# EAGLE design main (EAGLE 7.7.0)
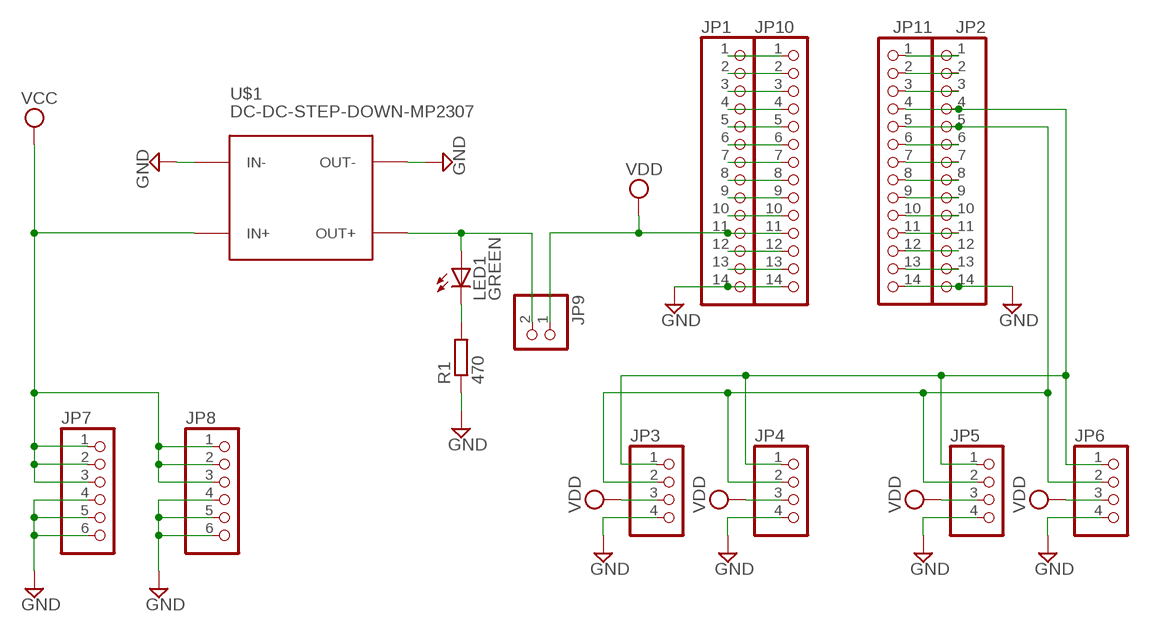
[diagram p0: schematic, sheet 1]

## Parts
JP1  PINHD-1X14_2.54  [1X14]
JP2  PINHD-1X14_2.54  [1X14]
JP3  PINHD-1X4_2.54-90°  [1X04/90]
JP4  PINHD-1X4_2.54-90°  [1X04/90]
JP5  PINHD-1X4_2.54  [1X04]
JP6  PINHD-1X4_2.54  [1X04]
JP7  PINHD-1X6_2.54-90°  [1X06/90]
JP8  PINHD-1X6_2.54-90°  [1X06/90]
JP9  PINHD-1X2_2.54  [1X02]
JP10  PINHD-1X14_2.54  [1X14]
JP11  PINHD-1X14_2.54  [1X14]
LED1  GREEN  LEDCHIP-LED0805  [CHIP-LED0805]
R1  470  R-EU_R0805  [R0805]
U$1  DC-DC-STEP-DOWN-MP2307  [DC-DC-STEP-DOWN-MP2307]

## Nets
+5V: JP9.2 LED1.A U$1.OUT+
GND: JP1.14 JP2.14 JP3.4 JP4.4 JP5.4 JP6.4 JP7.4 JP7.5 JP7.6 JP8.4 JP8.5 JP8.6 JP10.14 JP11.14 R1.1 U$1.IN- U$1.OUT-
N$1: JP1.1 JP10.1
N$2: JP1.2 JP10.2
N$3: JP1.3 JP10.3
N$4: LED1.C R1.2
N$5: JP1.4 JP10.4
N$6: JP1.5 JP10.5
N$7: JP1.6 JP10.6
N$8: JP1.7 JP10.7
N$9: JP1.8 JP10.8
N$10: JP1.9 JP10.9
N$11: JP1.10 JP10.10
N$12: JP1.12 JP10.12
N$13: JP1.13 JP10.13
N$14: JP2.1 JP11.1
N$15: JP2.2 JP11.2
N$16: JP2.3 JP11.3
N$17: JP2.6 JP11.6
N$18: JP2.7 JP11.7
N$19: JP2.8 JP11.8
N$20: JP2.9 JP11.9
N$21: JP2.10 JP11.10
N$22: JP2.11 JP11.11
N$23: JP2.12 JP11.12
N$24: JP2.13 JP11.13
SCL: JP2.4 JP3.1 JP4.1 JP5.1 JP6.1 JP11.4
SDA: JP2.5 JP3.2 JP4.2 JP5.2 JP6.2 JP11.5
VCC [VBAT]: JP7.1 JP7.2 JP7.3 JP8.1 JP8.2 JP8.3 U$1.IN+
VDD [VDD]: JP1.11 JP3.3 JP4.3 JP5.3 JP6.3 JP9.1 JP10.11

## Library data of the parts
JP1 JP2 JP10 JP11 = pinhead-1:PINHD-1X14: PIN HEADER
JP3-JP6 = pinhead-1:PINHD-1X4: PIN HEADER
JP7 JP8 = pinhead-1:PINHD-1X6: PIN HEADER
JP9 = pinhead-1:PINHD-1X2: PIN HEADER
LED1 = led:LED: LED OSRAM: - CHIPLED LG R971, LG N971, LY N971, LG Q971, LY Q971, LO R971, LY R971 LH N974, LH R974 LS Q976, LO Q976, LY Q976 LO Q996 - Hyper CHIPLED LW Q18S LB Q993, LB Q99A, LB R99A - SideLED LS A670, LO A670, LY A670, LG A670, LP A670 LB A673, LV A673, LT A673, LW A673 LH A674 LY A675 LS A676, LA A676, LO A676, LY A676, LW A676 LS A679, LY A679, LG A679 - Hyper Micro SIDELED® LS Y876, LA Y876, LO Y876, LY Y876 LT Y87S - SmartLED LW L88C, LW L88S LB L89C, LB L89S, LG L890 LS L89K, LO L89K, LY L89K LS L896, LA L896, LO L896, LY L896 - TOPLED LS T670, LO T670, LY T670, LG T670, LP T670 LSG T670, LSP T670, LSY T670, LOP T670, LYG T670 LG T671, LOG T671, LSG T671 LB T673, LV T673, LT T673, LW T673 LH T674 LS T676, LA T676, LO T676, LY T676, LB T676, LH T676, LSB T676, LW T676 LB T67C, LV T67C, LT T67C, LS T67K, LO T67K, LY T67K, LW E67C LS E67B, LA E67B, LO E67B, LY E67B, LB E67C, LV E67C, LT E67C LW T67C LS T679, LY T679, LG T679 LS T770, LO T770, LY T770, LG T770, LP T770 LB T773, LV T773, LT T773, LW T773 LH T774 LS E675, LA E675, LY E675, LS T675 LS T776, LA T776, LO T776, LY T776, LB T776 LHGB T686 LT T68C, LB T68C - Hyper Mini TOPLED® LB M676 - Mini TOPLED Santana® LG M470 LS M47K, LO M47K, LY M47K Source: http://www.osram.convergy.de LUXEON: - LUMILED® LXK2-PW12-R00, LXK2-PW12-S00, LXK2-PW14-U00, LXK2-PW14-V00 LXK2-PM12-R00, LXK2-PM12-S00, LXK2-PM14-U00 LXK2-PE12-Q00, LXK2-PE12-R00, LXK2-PE12-S00, LXK2-PE14-T00, LXK2-PE14-U00 LXK2-PB12-K00, LXK2-PB12-L00, LXK2-PB12-M00, LXK2-PB14-N00, LXK2-PB14-P00, LXK2-PB14-Q00 LXK2-PR12-L00, LXK2-PR12-M00, LXK2-PR14-Q00, LXK2-PR14-R00 LXK2-PD12-Q00, LXK2-PD12-R00, LXK2-PD12-S00 LXK2-PH12-R00, LXK2-PH12-S00 LXK2-PL12-P00, LXK2-PL12-Q00, LXK2-PL12-R00 Source: www.luxeon.com KINGBRIGHT: KA-3528ASYC Source: www.kingbright.com
R1 = resistor:R-EU_: RESISTOR, European symbol
U$1 = diy-modules:DC-DC-STEP-DOWN-MP2307: DC/DC Step-Down Regulator based on MP2307DN chip MP2307 datasheet available here: https://cdn-shop.adafruit.com/datasheets/MP2307_r1.9.pdf Click here to find device on ebay.com <http://www.ebay.com/sch/dc+dc+3a+mini+converter>

## Net classes
1 VBAT: width 2.54 mm
2 VDD: width 0.635 mm

## Board
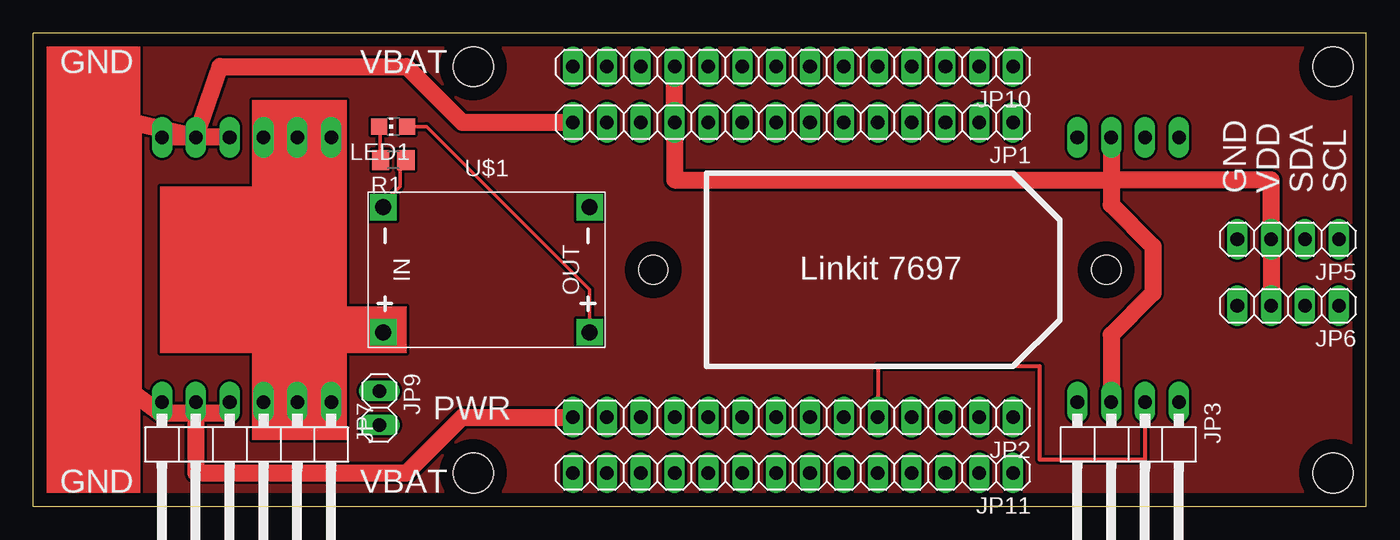
[diagram p1: board, top side]
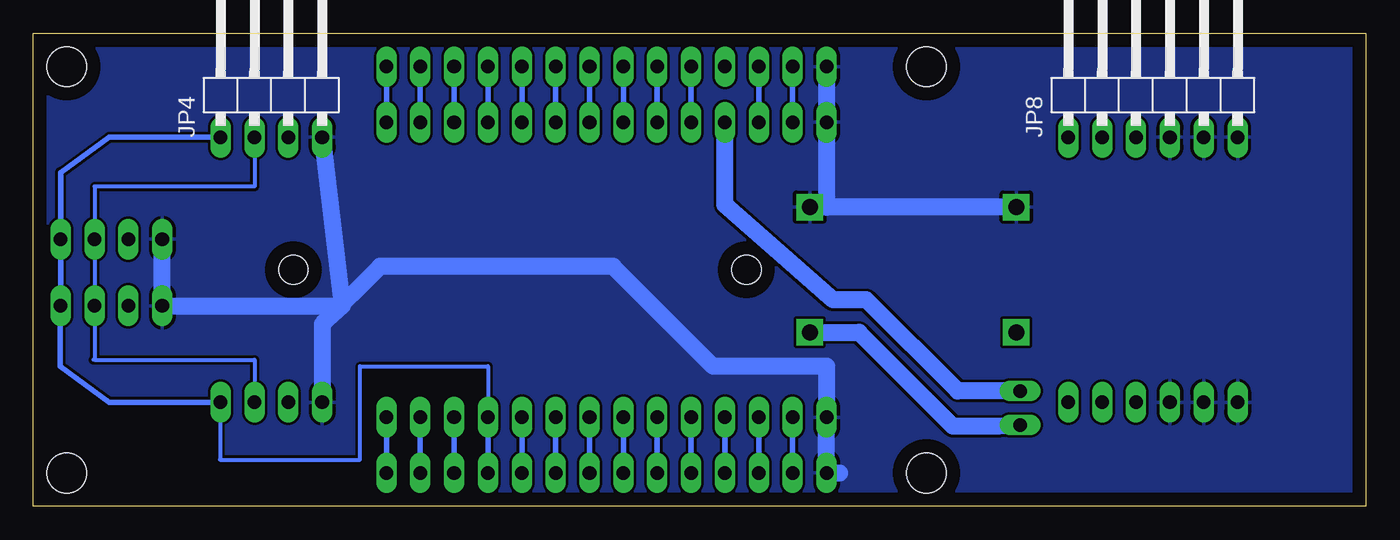
[diagram p2: board, bottom side, seen from below]

Size 100 x 35.5 mm. Coordinates in mm from the lower left corner, seen from the top.
Outline: 0,0 100,0 100,35.5 0,35.5 0,0
Copper layers (1*16): Top 0.035mm / dielectric 1.5mm / Bottom 0.035mm
Design rules "default": minimum track width 10mil, minimum drill 24mil, track to track 8mil, track to pad 8mil, pad to pad 8mil, via to via 8mil, smd to smd 8mil, copper to edge 40mil, drill to drill 8mil, minimum pad ring 10mil, minimum via ring 8mil, stop-mask expansion 4mil, vias tented up to drill 0mil, thermal gap 10mil
Holes 2.2 mm at 80.5,17.75 46.5,17.75
Holes 3 mm at 97.5,2.5 97.5,33 33,33 33,2.5

### Footprints (pad centres in the part's own frame; a part is rotated, then mirrored left to right if it is on the bottom)
1X14 = drill 1.016 long: 1 -16.51,0; 2 -13.97,0; 3 -11.43,0; 4 -8.89,0; 5 -6.35,0; 6 -3.81,0; 7 -1.27,0; 8 1.27,0; 9 3.81,0; 10 6.35,0; 11 8.89,0; 12 11.43,0; 13 13.97,0; 14 16.51,0
1X04/90 = drill 1.016 long: 1 -3.81,-3.81; 2 -1.27,-3.81; 3 1.27,-3.81; 4 3.81,-3.81
1X04 = drill 1.016 long: 1 -3.81,0; 2 -1.27,0; 3 1.27,0; 4 3.81,0
1X06/90 = drill 1.016 long: 1 -6.35,-3.81; 2 -3.81,-3.81; 3 -1.27,-3.81; 4 1.27,-3.81; 5 3.81,-3.81; 6 6.35,-3.81
1X02 = drill 1.016 long: 1 -1.27,0; 2 1.27,0
CHIP-LED0805 = smd 1.2 x 1.2: A 0,-1.05; C 0,1.05
R0805 = smd 1.3 x 1.5: 1 -0.95,0; 2 0.95,0
DC-DC-STEP-DOWN-MP2307 = drill 1.2 pad 2 square: IN+ -7.747,-4.699; IN- -7.747,4.699; OUT+ 7.747,-4.699; OUT- 7.747,4.699

### Placement (x,y rotation side)
JP1  57,28.82 180 top
JP2  57,6.68 180 top
JP3  82.14,4 180 top
JP4  82.14,31.5 0 bottom
JP5  94.14,20.04 180 top
JP6  94.14,15.04 180 top
JP7  16,4 180 top
JP8  16,31.5 0 bottom
JP9  25.96,7.37 270 top
JP10  57,33 180 top
JP11  57,2.5 180 top
LED1  27,28.5 90 top
R1  27,26 180 top
U$1  34,17.75 0 top

### Tracks (layer width: path | path; a pad name or v marks a point on that pad's centre or on a via)
+5V
  Top 0.254: LED1.A 29.5,28.5 41.75,16.25 U$1.OUT+
  Bottom 1.27: U$1.OUT+ 38.05,13.05 31,6 27.56,6 JP9.2
GND
  Top 0.254: 9.5,7 JP7.6 | 12,7 JP7.5 | R1.1 27.5,26 27.5,24 26.5,23 26.5,22.5 U$1.IN-
  Top 1.27: JP8.4 JP8.5 | JP8.5 JP8.6 | JP8.5 7.5,28.79 7.5,8.5 9.5,7 12,7 14.73,7 JP7.4 | JP7.5 12.19,2.5 28,2.5 32.18,6.68 JP2.14 | JP8.5 14,33 28,33 32.18,28.82 JP1.14
  Bottom 1.27: 39.5,2.5 JP11.14 JP2.14 40.49,10.5 49,10.5 56.5,18 74,18 78.33,13.67 | JP10.14 JP1.14 40.49,22.45 | U$1.IN- 40.49,22.45 | 40.49,22.45 U$1.OUT- | JP4.4 76.83,15.04 | 76.83,15.04 78.33,13.67 | 78.33,13.67 JP3.4 | 76.83,15.04 JP6.4 JP5.4
  pour Bottom: 0,35.5 0,0 100,0 100,35.5
N$1
  Bottom 0.406: JP10.1 JP1.1
N$2
  Bottom 0.406: JP10.2 JP1.2
N$3
  Bottom 0.406: JP10.3 JP1.3
N$4
  Top 0.254: LED1.C 26,28.5 26,26 R1.2
N$5
  Bottom 0.406: JP10.4 JP1.4
N$6
  Bottom 0.406: JP10.5 JP1.5
N$7
  Bottom 0.406: JP10.6 JP1.6
N$8
  Bottom 0.406: JP10.7 JP1.7
N$9
  Bottom 0.406: JP10.8 JP1.8
N$10
  Bottom 0.406: JP10.9 JP1.9
N$11
  Bottom 0.406: JP10.10 JP1.10
N$12
  Bottom 0.406: JP10.12 JP1.12
N$13
  Bottom 0.406: JP10.13 JP1.13
N$14
  Bottom 0.406: JP11.1 JP2.1
N$15
  Bottom 0.406: JP11.2 JP2.2
N$16
  Bottom 0.406: JP11.3 JP2.3
N$17
  Bottom 0.406: JP2.6 JP11.6
N$18
  Bottom 0.406: JP2.7 JP11.7
N$19
  Bottom 0.406: JP2.8 JP11.8
N$20
  Bottom 0.406: JP2.9 JP11.9
N$21
  Bottom 0.406: JP2.10 JP11.10
N$22
  Bottom 0.406: JP2.11 JP11.11
N$23
  Bottom 0.406: JP2.12 JP11.12
N$24
  Bottom 0.406: JP2.13 JP11.13
N$25
  pour Top: 0,35.5 0,0 100,0 100,35.5
SCL
  Bottom 0.305: JP3.1 86,6.76 86,3.5 75.5,3.5 75.5,10.5 65.89,10.5 JP2.4
  Bottom 0.406: JP11.4 JP2.4 | JP3.1 94.31,7.81 98,10.5 98,14.99 JP6.1 JP5.1 97.95,25.05 94.31,27.69 JP4.1
SDA
  Top 0.305: JP3.2 83.41,3.5 75.5,3.5 75.5,10.5 63.35,10.5 JP2.5
  Bottom 0.305: JP4.2 83.41,24 95.41,24 JP5.2 JP6.2 95.41,11 | 95.41,11 95.5,11 | 95.41,11 83.41,11 JP3.2
  Bottom 0.406: JP11.5 JP2.5
VCC
  Top 1.27: JP8.1 JP8.2 JP8.3 JP7.3 JP7.2 JP7.1 22,8.71 22,13 26.25,13 U$1.IN+
VDD
  Top 0.635: 92.5,20.5 JP5.3
  Top 1.27: JP10.11 JP1.11 48.11,24.5 80.87,24.5 | JP4.3 80.87,24.5 | 80.87,24.5 80.87,22.63 84,19.5 84,16 80.87,12.87 JP3.3 | 80.87,24.5 92.87,24.5 JP5.3 JP6.3
  Bottom 1.27: JP9.1 30.64,8.64 37.5,15.5 40,15.5 48.11,22.61 JP1.11
(copper drawn outside any net)
  shapes: Top area x4

### Text on the board
tPlace: GND | VBAT | GND | VDD | SDA | SCL | Linkit 7697 | PWR | GND | VBAT